# EAGLE design tracking_system (EAGLE 9.4.2)
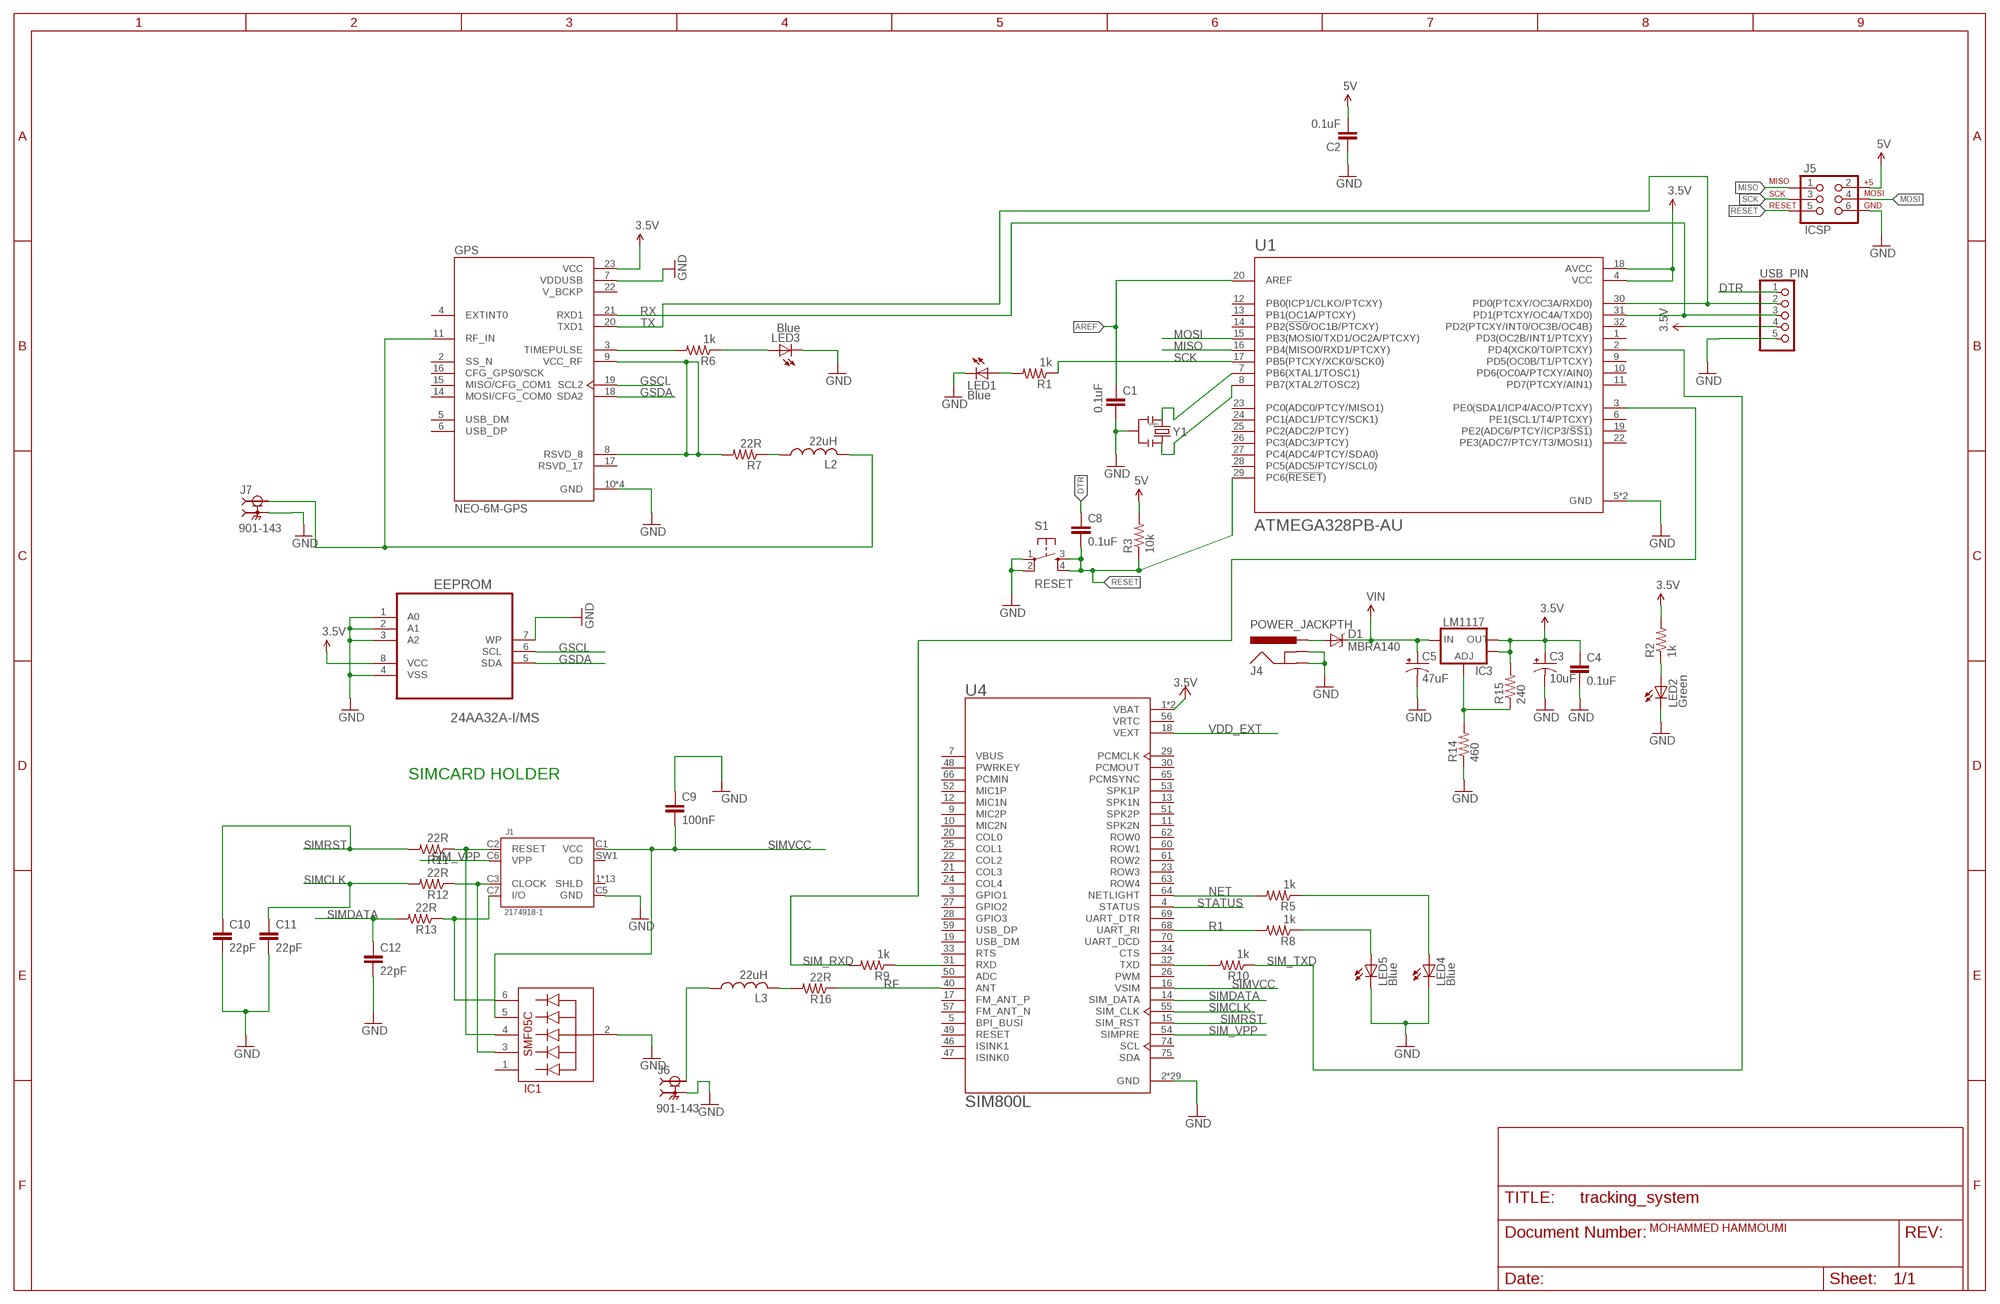
[diagram p0: schematic, sheet 1]

## Parts
C1  0.1uF  CAP0603-CAP  [0603-CAP]
C2  0.1uF  CAP0603-CAP  [0603-CAP]
C3  10uF  CAP_POL1206  [EIA3216]
C4  0.1uF  CAP0603-CAP  [0603-CAP]
C5  47uF  CAP_POLD  [PANASONIC_D]
C8  0.1uF  CAP0603-CAP  [0603-CAP]
C9  100nF  CAP0603-CAP  [0603-CAP]
C10  22pF  CAP0603-CAP  [0603-CAP]
C11  22pF  CAP0603-CAP  [0603-CAP]
C12  22pF  CAP0603-CAP  [0603-CAP]
D1  MBRA140  DIODE-SCHOTTKY_  [SMA-DIODE]
EEPROM  24AA32A-I/MS  [SOP65P490X110-8N]
GPS  NEO-6M-GPS  [XCVR_NEO-6M-GPS]
IC1  SMF05C  [SC-70-6]
IC3  LM1117  V_REG_LM1117ALT1  [SOT223-ALT1]
J1  2174918-1  [TE_2174918-1]
J4  POWER_JACKPTH  [POWER_JACK_PTH]
J5  ICSP  AVR_SPI_PRG_6PTH  [2X3]
J6  901-143  [AMPHENOL_901-143]
J7  901-143  [AMPHENOL_901-143]
L2  22uH  L-USL3225P  [L3225P]
L3  22uH  L-USL3225P  [L3225P]
LED1  Blue  LED1206-NS  [LED-1206-NO_SILK]
LED2  Green  LED1206-NS  [LED-1206-NO_SILK]
LED3  Blue  LED1206-NS  [LED-1206-NO_SILK]
LED4  Blue  LED1206-NS  [LED-1206-NO_SILK]
LED5  Blue  LED1206-NS  [LED-1206-NO_SILK]
R1  1k  RESISTOR0603-RES  [0603-RES]
R2  1k  RESISTOR0603-RES  [0603-RES]
R3  10k  RESISTOR0603-RES  [0603-RES]
R5  1k  RESISTOR0603-RES  [0603-RES]
R6  1k  RESISTOR0603-RES  [0603-RES]
R7  22R  RESISTOR0603-RES  [0603-RES]
R8  1k  RESISTOR0603-RES  [0603-RES]
R9  1k  RESISTOR0603-RES  [0603-RES]
R10  1k  RESISTOR0603-RES  [0603-RES]
R11  22R  RESISTOR0603-RES  [0603-RES]
R12  22R  RESISTOR0603-RES  [0603-RES]
R13  22R  RESISTOR0603-RES  [0603-RES]
R14  460  RESISTOR0603-RES  [0603-RES]
R15  240  RESISTOR0603-RES  [0603-RES]
R16  22R  RESISTOR0603-RES  [0603-RES]
S1  RESET  TAC_SWITCHSMD  [TACTILE_SWITCH_SMD]
U1  ATMEGA328PB-AU  [QFP80P900X900X120-32N]
U4  SIM800L  [MODULE_SIM800L]
USB_PIN  PINHD-1X5  [1X05]
Y1  16MHz  RESONATORSMD  [RESONATOR-SMD]

## Nets
3.3V: EEPROM.8(VCC) GPS.23(VCC) ; supply symbol labelled 3.5V
5V: C2.2 C3.A(+) C4.1 IC3.2(OUT) IC3.4(OUT) J5.2 R2.2 R3.2 R15.2 U1.4(VCC) U1.18(AVCC) USB_PIN.4 ; supply symbol labelled 3.5V
AREF: C1.1 U1.20(AREF)
DTR: C8.1 USB_PIN.1
GND: C1.2 C2.1 C3.C(-) C4.2 C5.- C9.1 C10.2 C11.2 C12.2 EEPROM.1(A0) EEPROM.2(A1) EEPROM.3(A2) EEPROM.4(VSS) EEPROM.7(WP) GPS.7(VDDUSB) GPS.10(GND) GPS.12(GND) GPS.13(GND) GPS.24(GND) IC1.2 J1.C5(GND) J4.GND J4.GNDBREAK J5.6 J6.2 J6.3 J6.4 J6.5 J7.2 J7.3 J7.4 J7.5 LED1.C LED2.C LED3.C LED4.C LED5.C R14.1 S1.1 S1.2 U1.5(GND) U1.21(GND) U4.2(GND) U4.6(GND) U4.8(GND) U4.35(GND) U4.37(GND) U4.38(GND) U4.39(GND) U4.41(GND) U4.43(GND) U4.44(GND) U4.45(GND) U4.58(GND) U4.67(GND) U4.71(GND) U4.72(GND) U4.73(GND) U4.76(GND) U4.77(GND) U4.78(GND) U4.79(GND) U4.80(GND) U4.81(GND) U4.82(GND) U4.83(GND) U4.84(GND) U4.85(GND) U4.86(GND) U4.87(GND) U4.88(GND) USB_PIN.5 Y1.2
GSCL: EEPROM.6(SCL) GPS.19(SCL2)
GSDA: EEPROM.5(SDA) GPS.18(SDA2)
MISO: J5.1 U1.16(PB4(MISO0/RXD1/PTCXY))
MOSI: J5.4 U1.15(PB3(MOSI0/TXD1/OC2A/PTCXY))
N$1: LED2.A R2.1
N$2: LED1.A R1.2
N$3: U1.7(PB6(XTAL1/TOSC1)) Y1.1
N$4: U1.8(PB7(XTAL2/TOSC2)) Y1.3
N$5: D1.A J4.PWR
N$6: GPS.3(TIMEPULSE) R6.2
N$7: LED3.A R6.1
N$8: GPS.8(RSVD_8) GPS.9(VCC_RF) R7.2
N$9: L2.1 R7.1
N$10: GPS.11(RF_IN) J7.1 L2.2
N$11: R9.1 U4.31(RXD)
N$12: R10.2 U4.32(TXD)
N$13: IC1.6 J1.C7(I/O) R13.1
N$14: LED5.A R8.1
N$15: IC3.1(ADJ) R14.2 R15.1
N$16: LED4.A R5.1
N$17: IC1.3 J1.C3(CLOCK) R12.1
N$19: IC1.4 J1.C2(RESET) R11.1
N$20: L3.2 R16.2
N$22: J6.1 L3.1
NET: R5.2 U4.64(NETLIGHT)
R1: R8.2 U4.68(UART_RI)
RESET: C8.2 J5.5 R3.1 S1.3 S1.4 U1.29(PC6(!RESET!))
RF: R16.1 U4.40(ANT)
RX: GPS.21(RXD1) U1.31(PD1(PTCXY/OC4A/TXD0)) USB_PIN.3
SCK: J5.3 R1.1 U1.17(PB5(PTCXY/XCK0/SCK0))
SIM_RXD: R9.2 U1.3(PE0(SDA1/ICP4/ACO/PTCXY))
SIM_TXD: R10.1 U1.2(PD4(XCK0/T0/PTCXY))
SIM_VPP: J1.C6(VPP) U4.54(SIMPRE)
SIMCLK: C11.1 R12.2 U4.55(SIM_CLK)
SIMDATA: C12.1 R13.2 U4.14(SIM_DATA)
SIMRST: C10.1 R11.2 U4.15(SIM_RST)
SIMVCC: C9.2 IC1.5 J1.C1(VCC) U4.16(VSIM)
STATUS: U4.4(STATUS)
TX: GPS.20(TXD1) U1.30(PD0(PTCXY/OC3A/RXD0)) USB_PIN.2
VCC: U4.1(VBAT) U4.42(VBAT) ; supply symbol labelled 3.5V
VDD_EXT: U4.18(VEXT)
VIN: C5.+ D1.C IC3.3(IN)
Unconnected: GPS.2(SS_N) GPS.4(EXTINT0) GPS.5(USB_DM) GPS.6(USB_DP) GPS.14(MOSI/CFG_COM0) GPS.15(MISO/CFG_COM1) GPS.16(CFG_GPS0/SCK) GPS.17(RSVD_17) IC1.1 J1.SW1(CD) U1.1(PD3(OC2B/INT1/PTCXY)) U1.6(PE1(SCL1/T4/PTCXY)) U1.9(PD5(OC0B/T1/PTCXY)) U1.10(PD6(OC0A/PTCXY/AIN0)) U1.11(PD7(PTCXY/AIN1)) U1.12(PB0(ICP1/CLKO/PTCXY)) U1.13(PB1(OC1A/PTCXY)) U1.14(PB2(!SS0!/OC1B/PTCXY)) U1.19(PE2(ADC6/PTCY/ICP3/!SS1!)) U1.22(PE3(ADC7/PTCY/T3/MOSI1)) U1.23(PC0(ADC0/PTCY/MISO1)) U1.24(PC1(ADC1/PTCY/SCK1)) U1.25(PC2(ADC2/PTCY)) U1.26(PC3(ADC3/PTCY)) U1.27(PC4(ADC4/PTCY/SDA0)) U1.28(PC5(ADC5/PTCY/SCL0)) U1.32(PD2(PTCXY/INT0/OC3B/OC4B)) U4.3(GPIO1) U4.5(BPI_BUSI) U4.7(VBUS) U4.9(MIC2P) U4.10(MIC2N) U4.11(SPK2N) U4.12(MIC1N) U4.13(SPK1N) U4.17(FM_ANT_P) U4.19(USB_DM) U4.20(COL0) U4.21(COL3) U4.22(COL2) U4.23(ROW3) U4.24(COL4) U4.25(COL1) U4.26(PWM) U4.27(GPIO2) U4.28(GPIO3) U4.29(PCMCLK) U4.30(PCMOUT) U4.33(RTS) U4.34(CTS) U4.46(ISINK1) U4.47(ISINK0) U4.48(PWRKEY) U4.49(RESET) U4.50(ADC) U4.51(SPK2P) U4.52(MIC1P) U4.53(SPK1P) U4.57(FM_ANT_N) U4.59(USB_DP) U4.60(ROW1) U4.61(ROW2) U4.62(ROW0) U4.63(ROW4) U4.65(PCMSYNC) U4.66(PCMIN) U4.69(UART_DTR) U4.70(UART_DCD) U4.74(SCL) U4.75(SDA)

## Notes on the sheet
- SIMCARD HOLDER
- MOHAMMED HAMMOUMI

## Power pins joined to a net without a drawn wire
SHLD: J1.1(SHLD) J1.2(SHLD) J1.3(SHLD) J1.4(SHLD) J1.5(SHLD) J1.6(SHLD) J1.7(SHLD) J1.8(SHLD) J1.9(SHLD) J1.10(SHLD) J1.11(SHLD) J1.12(SHLD) J1.13(SHLD)
V_BCKP: GPS.22(V_BCKP)
VRTC: U4.56(VRTC)

## Library data of the parts
C1 C2 C4 C8-C12 = SparkFun:CAP: Capacitor Standard 0603 ceramic capacitor, and 0.1" leaded capacitor.; OC_FARNELL: unknown
C3 = SparkFun:CAP_POL: Capacitor Polarized These are standard SMD and PTH capacitors. Normally 10uF, 47uF, and 100uF in electrolytic and tantalum varieties. Always verify the external diameter of the through hole cap, it varies with capacity, voltage, and manufacturer. The EIA devices should be standard.; OC_FARNELL: unknown
C5 = SparkFun:CAP_POL: Capacitor Polarized These are standard SMD and PTH capacitors. Normally 10uF, 47uF, and 100uF in electrolytic and tantalum varieties. Always verify the external diameter of the through hole cap, it varies with capacity, voltage, and manufacturer. The EIA devices should be standard.; MF: PANASONIC ELECTRONIC COMPONENTS; MPN: EEE1CA470SP; OC_FARNELL: 9696946
D1 = SparkFun:DIODE-SCHOTTKY; MF: DIODES INC.; MPN: B140-13-F; OC_FARNELL: 1843670
EEPROM = 24AA32A-I_MS:24AA32A-I/MS: IC EEPROM 32KBIT 400KHZ; AVAILABILITY: Unavailable; DESCRIPTION: 24AA32A Series 32 Kbit _4K X 8_ 5.5 V Surface Mount I2C Serial EEPROM - MSOP-8; MF: Microchip; MP: 24AA32A-I/MS; PACKAGE: MSOP-8 Microchip; PRICE: None
GPS = NEO-6M-GPS:NEO-6M-GPS: SMD GPS Module; AVAILABILITY: Unavailable; DESCRIPTION: SMD GPS Module;; MF: u-blox; MP: NEO-6M-GPS; PACKAGE: None; PRICE: None
IC1 = SMF05C:SMF05C; AVAILABILITY: Unavailable; MF: ON Semiconductor; MP: SMF05C; PACKAGE: SOT-363 ON Semiconductor; PRICE: None
IC3 = Testing:V_REG_LM1117: Voltage Regulator LM1117 Standard adjustable voltage regulator but in SMD form. Spark Fun Electronics SKU : COM-00595; MF: STMICROELECTRONICS; MPN: LD1117S33TR; OC_FARNELL: 1202826
J1 = 2174918-1:2174918-1: PUSH-PUSH SIM CONNECTOR SUPER LO; AVAILABILITY: Unavailable; COMMENT: 2174918-1; DESCRIPTION: Conn SIM Card M 6 POS 2.54mm Solder ST SMD Embossed T/R; EU_ROHS_COMPLIANCE: Compliant; MF: TE Connectivity; MP: 2174918-1; PACKAGE: None; PRICE: None; TE_PURCHASE_URL: https://www.te.com/usa-en/product-2174918-1.html?te_bu=Cor&te_type=disp&te_campaign=seda_glo_cor-seda-global-disp-prtnr-fy19-seda-model-bom-cta_sma-317_1&elqCampaignId=32493
J4 = SparkFun-Connectors:POWER_JACK: Power Jack This is the standard 5.5mm barrel jack for power. The PTH is the most common, proven, reliable, footprint. The Slot footprint only works if the mill layer is transmitted to the PCB fab house so be warned. Mating wall wart : TOL-00298 (and others); OC_FARNELL: unknown; PROD_ID: CONN-08197
J5 = SparkFun-Connectors:AVR_SPI_PRG_6: AVR ISP 6 Pin This is the reduced ISP connector for AVR programming. Common on Arduino. This footprint will take up less PCB space and can be used with a 10-pin to 6-pin adapter such as SKU: BOB-08508 **Special note about "TEST_POINT" package. The stop mask is on the top side, so if you want your programming test points to be on the bottom of your board, make sure to place this package on the bottom side of the board. This also ensure that the orientation to program from the bottom side will be correct.; OC_FARNELL: unknown
J6 = 901-143:901-143: connector, rf coaxial, sma rt angle pcb jack recept, 4 legs, blunt post terminal; AVAILABILITY: Unavailable; DESCRIPTION: connector, rf coaxial, sma rt angle pcb jack recept, 4 legs, blunt post terminal; MF: Amphenol RF; MP: 901-143; PACKAGE: None; PRICE: None
J7 = 901-143:901-143: connector, rf coaxial, sma rt angle pcb jack recept, 4 legs, blunt post terminal; AVAILABILITY: Unavailable; DESCRIPTION: connector, rf coaxial, sma rt angle pcb jack recept, 4 legs, blunt post terminal; MF: Amphenol RF; MP: 901-143; PACKAGE: None; PRICE: None; SPICEPREFIX: B
L2 L3 = rcl:L-US: INDUCTOR, American symbol; SPICEPREFIX: L
LED1-LED5 = SparkFun-LED:LED: LEDs Standard schematic elements and footprints for 5mm, 3mm, 1206, and 0603 sized LEDs. 5mm - Spark Fun Electronics SKU : COM-00529 (and others); OC_FARNELL: unknown
R1-R3 R5-R14 R16 = SparkFun:RESISTOR: Resistor Basic schematic elements and footprints for 0603, 1206, and PTH resistors.; OC_FARNELL: unknown
R15 = SparkFun:RESISTOR: Resistor Basic schematic elements and footprints for 0603, 1206, and PTH resistors.; OC_FARNELL: unknown; SPICEPREFIX: R
S1 = SparkFun:TAC_SWITCH: Momentary Switch Button commonly used for reset or general input. Spark Fun Electronics SKU : COM-00097; OC_FARNELL: unknown
U1 = ATMEGA328PB-AU:ATMEGA328PB-AU: ATmega Series 20 MHz 32 KB Flash 2 KB SRAM 8-Bit Microcontroller - TQFP-32; AVAILABILITY: Unavailable; DESCRIPTION: AVR microcontroller; EEPROM: 1024B; SRAM: 2kB; Flash: 32kB; TQFP32; MF: Microchip; MP: ATMEGA328PB-AU; PACKAGE: TQFP-32 Microchip; PRICE: None
U4 = SIM800L:SIM800L: SIM8000L. Quad-band GSM/GPRS Module; AVAILABILITY: Unavailable; MF: Simcom; MP: SIM800L; PACKAGE: None; PRICE: None
USB_PIN = pinhead:PINHD-1X5: PIN HEADER
Y1 = SparkFun-FreqCtrl:RESONATOR: Resonator Small SMD resonator. This is the itty bitty 10/20MHz resonators with built in caps. CSTCE10M0G55 and CSTCE20M0V53. Footprint has been reviewed closely but hasn't been tested yet.; OC_FARNELL: unknown

## Net classes
0 default: width 0.152 mm, drill 0.305 mm, clearance 0.152 mm

## Board
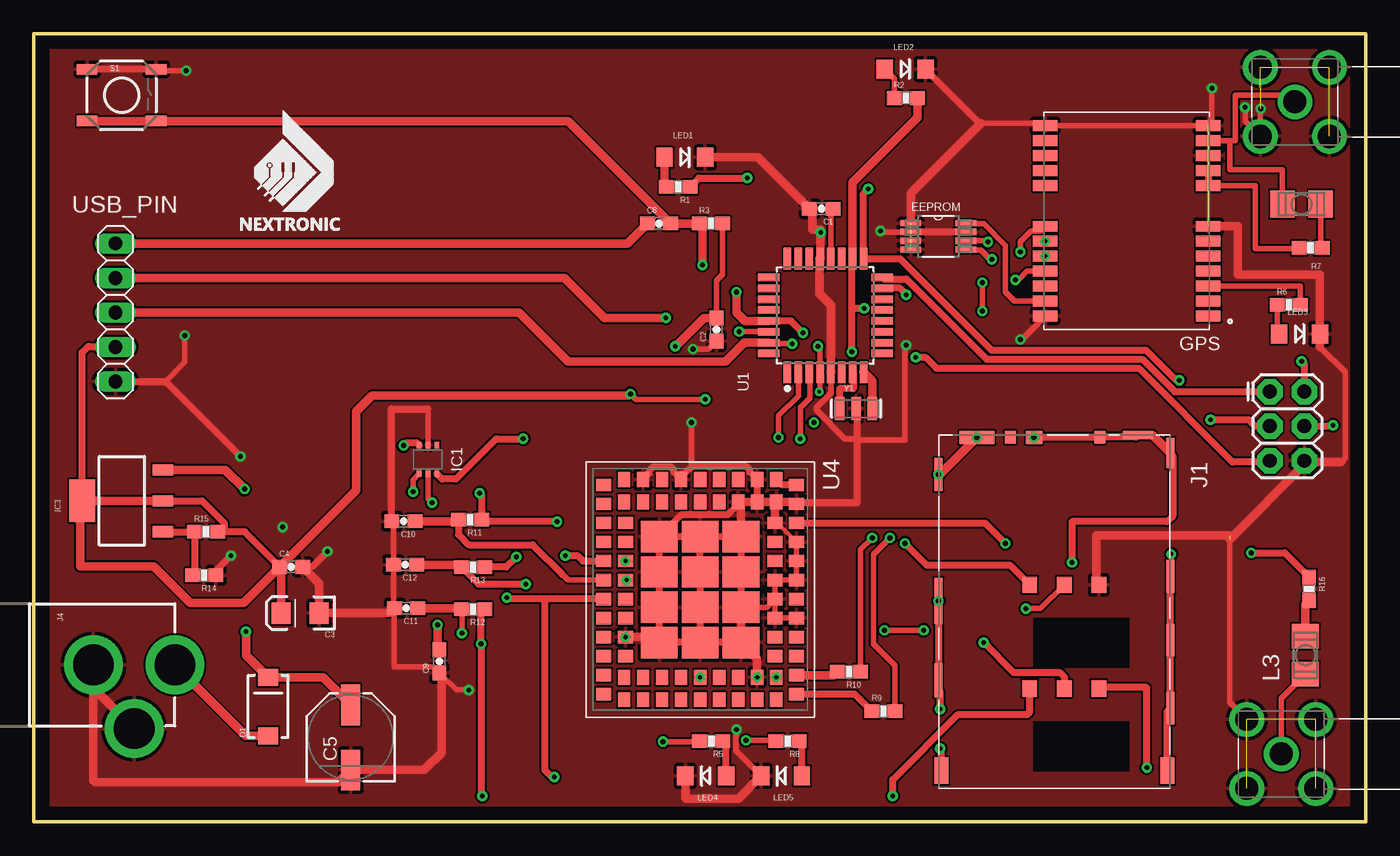
[diagram p1: board, top side]
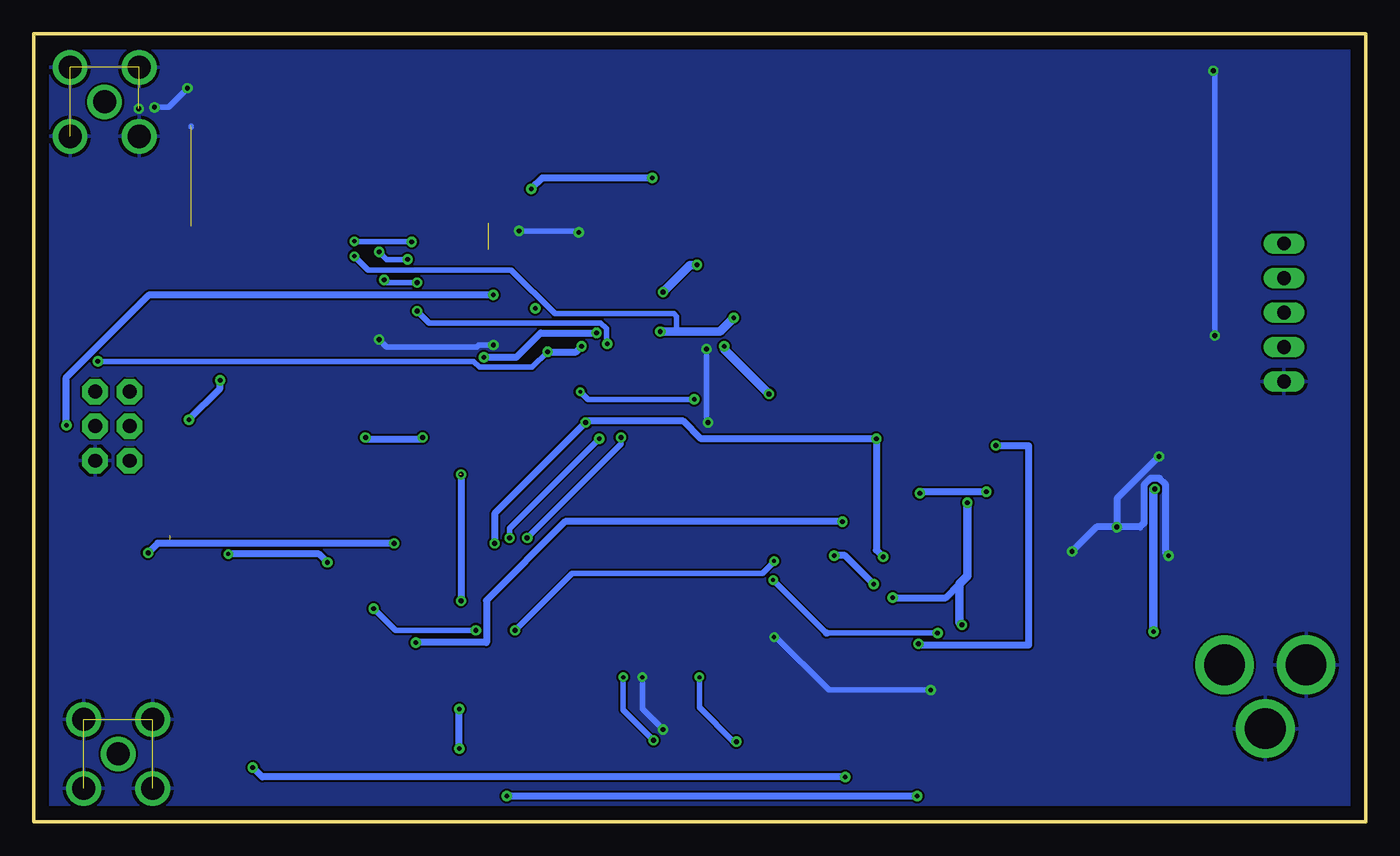
[diagram p2: board, bottom side, seen from below]

Size 98 x 58 mm. Coordinates in mm from the lower left corner, seen from the top.
Outline: 0,0 98,0 98,58 0,58 0,0
Copper layers (1*16): Top 0.035mm / dielectric 1.5mm / Bottom 0.035mm
Design rules "default": minimum track width 6mil, minimum drill 0.35mm, track to track 6mil, track to pad 6mil, pad to pad 6mil, via to via 6mil, smd to smd 6mil, copper to edge 40mil, drill to drill 6mil, minimum pad ring 10mil, minimum via ring 8mil, stop-mask expansion 4mil, vias tented up to drill 0mil, thermal gap 10mil

### Footprints (pad centres in the part's own frame; a part is rotated, then mirrored left to right if it is on the bottom)
0603-CAP = smd 1.1 x 1: 1 -0.85,0; 2 0.85,0
EIA3216 = smd 1.4 x 1.6: A 1.4,0; C -1.4,0
PANASONIC_D = smd 3 x 1.4: + 2.4,0; - -2.4,0
SMA-DIODE = smd 1.27 x 1.47: A -2.15,0; C 2.15,0
SOP65P490X110-8N = smd 1.524 x 0.457: 1 -2.032,0.965; 2 -2.032,0.33; 3 -2.032,-0.33; 4 -2.032,-0.965; 5 2.032,-0.965; 6 2.032,-0.33; 7 2.032,0.33; 8 2.032,0.965
XCVR_NEO-6M-GPS = smd 1.8 x 0.8: 1 -6,7; 2 -6,5.9; 3 -6,4.8; 4 -6,3.7; 5 -6,2.6; 6 -6,1.5; 7 -6,0.4; 8 -6,-2.6; 9 -6,-3.7; 10 -6,-4.8; 11 -6,-5.9; 12 -6,-7; 13 6,-7; 14 6,-5.9; 15 6,-4.8; 16 6,-3.7; 17 6,-2.6; 18 6,0.4; 19 6,1.5; 20 6,2.6; 21 6,3.7; 22 6,4.8; 23 6,5.9; 24 6,7
SC-70-6 = smd 0.35 x 0.5: 1 -0.65,-1.05; 2 0,-1.05; 3 0.65,-1.05; 4 0.65,1.05; 5 0,1.05; 6 -0.65,1.05
SOT223-ALT1 = smd 0.813 x 1.524: 1 -2.271,-3.02; 2 0,-3.02; 3 2.288,-3.02 | smd 3.124 x 1.905: 4 0,2.921
TE_2174918-1 = smd 1.95 x 1.03: 1 11.7,8.315; 13 11.7,-8.315 | smd 2.4 x 0.6: 2 7.1,8.53; 3 2.1,8.53; 4 -2.6,8.53; 10 -10.1,-8.53 | smd 2.23 x 0.6: 5 -11.685,8.53 | smd 0.6 x 2.2: 6 -13,6.15 | smd 0.9 x 0.8: 7 -12.85,3.35; SW1 -12.85,-3.25 | smd 0.95 x 1.2: 8 -12.825,-1.5 | smd 0.95 x 2.6: 9 -12.825,-5.7 | smd 3.4 x 0.6: 11 -0.8,-8.53 | smd 2.5 x 0.6: 12 5.05,-8.53 | smd 1.2 x 1.1: C1 5.65,3.26; C2 5.65,0.72; C3 5.65,-1.82; C5 -1.97,3.26; C6 -1.97,0.72; C7 -1.97,-1.82
POWER_JACK_PTH = drill 2.997 pad 4.318: GND 0,7.7; GNDBREAK 4.7,10.7; PWR 0,13.7
2X3 = drill 1.016 pad 1.88 octagon: 1 0,0; 2 0,2.54; 3 2.54,0; 4 2.54,2.54; 5 5.08,0; 6 5.08,2.54
AMPHENOL_901-143 = drill 1.7: 1 0,0; 2 -2.54,2.54; 3 -2.54,-2.54; 4 2.54,-2.54; 5 2.54,2.54
L3225P = smd 1.8 x 2: 1 -1.4,0; 2 1.4,0
LED-1206-NO_SILK = smd 1.2 x 1.4: A -1.5,0; C 1.5,0
0603-RES = smd 1.1 x 1: 1 -0.85,0; 2 0.85,0
TACTILE_SWITCH_SMD = smd 1.524 x 0.762: 1 -2.54,1.905; 2 2.54,1.905; 3 -2.54,-1.905; 4 2.54,-1.905
QFP80P900X900X120-32N = smd 1.6 x 0.55: 1 -4.18,2.8; 2 -4.18,2; 3 -4.18,1.2; 4 -4.18,0.4; 5 -4.18,-0.4; 6 -4.18,-1.2; 7 -4.18,-2; 8 -4.18,-2.8; 17 4.18,-2.8; 18 4.18,-2; 19 4.18,-1.2; 20 4.18,-0.4; 21 4.18,0.4; 22 4.18,1.2; 23 4.18,2; 24 4.18,2.8 | smd 0.55 x 1.6: 9 -2.8,-4.18; 10 -2,-4.18; 11 -1.2,-4.18; 12 -0.4,-4.18; 13 0.4,-4.18; 14 1.2,-4.18; 15 2,-4.18; 16 2.8,-4.18; 25 2.8,4.18; 26 2,4.18; 27 1.2,4.18; 28 0.4,4.18; 29 -0.4,4.18; 30 -1.2,4.18; 31 -2,4.18; 32 -2.8,4.18
MODULE_SIM800L = smd 1.1 x 0.9: 1 -8.1,5.6; 2 -8.1,4.2; 3 -8.1,2.8; 4 -8.1,1.4; 5 -8.1,0; 6 -8.1,-1.4; 7 -8.1,-2.8; 8 -8.1,-4.2; 9 -8.1,-5.6; 22 8.1,-5.6; 23 8.1,-4.2; 24 8.1,-2.8; 25 8.1,-1.4; 26 8.1,0; 27 8.1,1.4; 28 8.1,2.8; 29 8.1,4.2; 30 8.1,5.6; 43 -6.45,5.6; 44 -6.45,4.2; 45 -6.45,2.8; 46 -6.45,1.4; 47 -6.45,0; 48 -6.45,-1.4; 49 -6.45,-2.8; 50 -6.45,-4.2; 51 -6.45,-5.6; 60 6.45,-5.6; 61 6.45,-4.2; 62 6.45,-2.8; 63 6.45,-1.4; 64 6.45,0; 65 6.45,1.4; 66 6.45,2.8; 67 6.45,4.2; 68 6.45,5.6 | smd 0.9 x 1.1: 10 -7.7,-7.1; 11 -6.3,-7.1; 12 -4.9,-7.1; 13 -3.5,-7.1; 14 -2.1,-7.1; 15 -0.7,-7.1; 16 0.7,-7.1; 17 2.1,-7.1; 18 3.5,-7.1; 19 4.9,-7.1; 20 6.3,-7.1; 21 7.7,-7.1; 31 7.7,7.1; 32 6.3,7.1; 33 4.9,7.1; 34 3.5,7.1; 35 2.1,7.1; 36 0.7,7.1; 37 -0.7,7.1; 38 -2.1,7.1; 39 -3.5,7.1; 40 -4.9,7.1; 41 -6.3,7.1; 42 -7.7,7.1; 52 -4.9,-5.5; 53 -3.5,-5.5; 54 -2.1,-5.5; 55 -0.7,-5.5; 56 0.7,-5.5; 57 2.1,-5.5; 58 3.5,-5.5; 59 4.9,-5.5; 69 4.9,5.5; 70 3.5,5.5; 71 2.1,5.5; 72 0.7,5.5; 73 -0.7,5.5; 74 -2.1,5.5; 75 -3.5,5.5; 76 -4.9,5.5 | smd 2.3 x 2.7: 77 -3.9,3; 78 -3.9,0; 79 -3.9,-3; 80 -1.3,-3; 81 1.3,-3; 82 3.9,-3; 83 3.9,0; 84 3.9,3; 85 1.3,3; 86 -1.3,3; 87 -1.3,0; 88 1.3,0
1X05 = drill 1.016 long: 1 -5.08,0; 2 -2.54,0; 3 0,0; 4 2.54,0; 5 5.08,0
RESONATOR-SMD = smd 0.7 x 1.7: 1 -1.2,0; 2 0,0; 3 1.2,0

### Placement (x,y rotation side)
C1  57.94,45.13 180 top
C2  50.23,36.25 90 top
C3  19.61,15.37 180 top
C4  18.94,18.77 0 top
C5  23.31,6.22 90 top
C8  46.01,44.05 0 top
C9  29.83,11.82 90 top
C10  27.19,22.13 180 top
C11  27.4,15.73 180 top
C12  27.31,18.93 180 top
D1  17.23,8.49 90 top
EEPROM  66.56,43.1 0 top
GPS  80.42,44.24 180 top
IC1  29,26.68 180 top
IC3  6.47,23.63 90 top
J1  75.1,15.47 270 top
J4  -3.33,11.56 270 top
J5  90.96,31.67 270 top
J6  91.8,5 270 top
J7  92.8,53 270 top
L2  93.29,45.47 180 top
L3  93.57,12.26 90 top
LED1  47.9,48.92 0 top
LED2  64.12,55.42 0 top
LED3  93.14,35.92 0 top
LED4  49.44,3.38 180 top
LED5  55.02,3.38 180 top
R1  47.42,46.73 180 top
R2  64.17,53.27 0 top
R3  49.84,44.05 0 top
R5  49.84,5.95 180 top
R6  92.35,38.05 0 top
R7  93.96,42.25 180 top
R8  55.47,5.95 180 top
R9  62.52,8.15 0 top
R10  59.99,11.05 180 top
R11  32.1,22.25 180 top
R12  32.31,15.65 180 top
R13  32.32,18.75 180 top
R14  12.53,18.15 180 top
R15  12.66,21.35 0 top
R16  93.85,17.15 270 top
S1  6.45,53.49 0 top
U1  58.25,37.28 90 top
U4  49.03,17.1 270 top
USB_PIN  6,37.5 270 top
Y1  60.5,30.42 0 top

### Tracks (layer width: path | path; a pad name or v marks a point on that pad's centre or on a via)
3.3V
  Top 0.406: EEPROM.8 68.62,44.04 69.9,44.04 71.5,42.44 71.5,39 72.16,38.34 GPS.23
5V  (via drill 0.25, 0.35)
  Top 0.406: C2.2 50.23,39.83 50.69,40.28 R3.2 | v57.79,31.66 57.85,31.72 U1.4 57.85,34.85 v57.7,35 | v49.4,31.1 44.3,31.1 v43.9,31.5
  Top 0.508: C4.1 15.51,21.35 14,21.35 | 14,21.35 R15.2 | IC3.2 12.37,23.63 14,22 14,21.35 | USB_PIN.4 5.96,35 4,35 3.55,34.55 IC3.4 3.4,23.48 | v60.2,34.6 60.2,37.8 | 60.2,37.8 60.2,41.41 U1.18 | v61.1,37.8 60.2,37.8 | v93.3,33.9 93.5,33.7 J5.2
  Top 0.61: R2.2 65.02,51.82 60.25,47.05 U1.18 | C4.1 18.2,18.66 C3.A | C4.1 15.42,16.1 11.5,16.1 8.8,18.8 3.4,18.8 3.4,23.48 | C4.1 23.7,24.38 23.7,30.2 24.9,31.4 43.8,31.4 v43.9,31.5 | v47.2,35 49.3,37.1 C2.2 | IC3.2 IC3.4
  Bottom 0.406: v93.3,33.9 65.64,33.9 65.2,33.47 61.33,33.47 v60.2,34.6 | v57.79,31.66 57.23,31.1 v49.4,31.1
  Bottom 0.508: v60.2,34.6 58.1,34.6 v57.7,35
  Bottom 0.61: v43.9,31.5 47.2,34.8 v47.2,35
AREF
  Top 0.406: U1.20 58.65,44.99 C1.1
DTR
  Top 0.61: C8.1 43.69,42.58 USB_PIN.1
GND  (via drill 0.3, 0.35)  (13 unrouted)
  Top 0.305: U4.76 54.73,22 55.27,21.45 55.27,21.42 55.45,21.25 55.48,21.25 U4.39
  Top 0.406: U4.39 U4.38 U4.37 U4.73 U4.72 | U4.72 U4.71 U4.35 | U4.85 53.93,15.8 U4.72 | C10.2 26.46,22.01 C12.2 26.46,15.82 C11.2 26.5,15.68 26.5,11.4 29.4,11.4 C9.1 | 69.7,51.44 74.42,51.44 GPS.13 GPS.12 86.7,51.52 v86.7,54 | J6.3 88.01,8.79 88.01,21.1 | v90.3,52.5 90.26,52.46 J7.4 89.13,51.59 v89.13,52.6 | 30,10.8 31.1,9.7 v32,9.7 | v51.7,6.8 51.7,6.34 51.67,6.3 51.67,5.23 LED5.C | 29,30.4 IC1.2 | 9.68,32.42 11.1,33.84 v11.1,35.8 | v11.2,55.3 9.09,55.3 S1.2 | U1.5 58.65,31.55 57.6,30.5 57.6,30.3 59.7,28.2 60.6,28.2 60.7,28.1 64.1,28.1 64.1,35 v64.2,35.1 | EEPROM.2 62.37,43.43 v62.3,43.5 | GPS.24 72.7,35.52 72.7,35.5 v72.61,35.5 v72.6,35.51 | C2.1 49.63,34.8 v48.5,34.8 | v48.4,29.4 48.4,26.17 48.41,26.16 | 96.2,26.5 96.5,26.8 96.5,33.1 94.64,34.96
  Top 0.508: 29,30.4 26.3,30.4 26.3,22.17 C10.2 | EEPROM.7 EEPROM.2 | GPS.13 74.52,51.14 | R14.1 13.38,18.48 v14.5,19.6 | v21.6,19.9 20.47,18.77 C4.2 | U4.78 U4.87 U4.88 49.03,13.83 49,13.8 49,13.23 U4.83 | U4.83 U4.82 U4.81 U4.80 U4.79 | U4.79 U4.78 | U4.78 U4.77 U4.86 52.03,15.5 | U4.84 U4.83 | U4.8 45.27,25.64 45.27,25.82 45.61,26.16 46.85,26.16 47.09,25.92 47.09,25.74 47.27,25.57 | 47.27,25.57 U4.6 | U4.44 U4.2 52.69,25.74 52.69,25.92 52.45,26.16 48.41,26.16 47.82,25.57 47.27,25.57 | U4.41 56.23,23.5 60.6,23.5 60.6,28.2 60.6,30.32 Y1.2 | U4.79 47.62,22.59 51.05,22.59 51.8,23.35 52.03,23.35 | S1.2 S1.1 | USB_PIN.5 9.68,32.42 v15.2,26.9 | LED2.C 69.6,51.44 69.7,51.44
  Top 0.61: U4.58 45.63,13.6 U4.82 | LED5.C 51.84,1.7 48,1.7 47.94,1.76 LED4.C | U1.5 58.65,38.05 57.8,38.9 57.8,41.41 U1.21 57.9,41.51 v57.9,43.4 57.9,43.6 57.3,43.6 57.3,44.92 C1.2 53.3,48.92 LED1.C | EEPROM.1 64.53,46.27 69.7,51.44 | GPS.7 88.6,43.84 88.6,40.3 94.64,40.3 LED3.C 94.64,34.96 | 96.2,26.5 93.59,26.5 J5.6 93.5,26.29 88.01,20.8 | 88.01,21.1 78.2,21.1 78.2,17.6 J1.C5 | U4.67 53.23,12 U4.84 52.03,15.5 U4.85 | U4.77 52.03,23.35 U4.45 U4.44 U4.43 | U4.43 54.53,23.45 U4.76 | U4.43 55.98,23.55 U4.41 | C9.1 30,10.8 30,5.1 28.72,3.82 C5.- 22.39,2.9 4.5,2.9 4.37,3.03 J4.GND 4.37,9.86 J4.GNDBREAK | C4.2 21,17.55 C3.C 26.19,15.37 26.5,15.68
  Bottom 0.406: 86.42,51.22 86.42,51.14 | v32,9.7 39.5,9.7 43.5,13.7 43.53,13.67 U4.58 | U4.67 53.23,8.33 v51.7,6.8 | v11.1,35.8 11.1,55.2 v11.2,55.3 | v62.3,43.5 58,43.5 v57.9,43.4 | v64.2,35.1 65.26,35.1 65.4,34.97 72.06,34.97 v72.6,35.51 | v48.5,34.8 48.5,29.5 v48.4,29.4 | v89.13,52.6 88.1,52.6 v86.7,54
  Bottom 0.508: v18.3,21.7 16.6,21.7 16.31,21.99 16.31,24.8 15.82,25.29 15.18,25.29 14.71,24.82 14.71,19.82 v14.5,19.6 | v18.3,21.7 19.8,21.7 v21.6,19.9 | v15.2,26.9 18.3,23.8 v18.3,21.7
  other vias: 43.53,13.6 53.23,10.65
  pour Top: -1,59 -1,-1 99,-1 99,59
  pour Bottom: -1,58 -1,-1 99,-1 99,59 -1,59
GSCL  (via drill 0.3, 0.35)
  Top 0.406: EEPROM.6 70.13,42.77 v70.2,42.7
  Bottom 0.406: GPS.19 74.38,42.7 v70.2,42.7
  other vias: 74.42,42.74
GSDA  (via drill 0.35)
  Top 0.406: EEPROM.5 68.63,42.1 69.7,42.1 70.4,41.4 v70.5,41.4 | GPS.18 74.08,43.5 73.37,43.5 72.6,42.72 v72.6,41.97
  Bottom 0.406: v70.5,41.4 72.03,41.4 v72.6,41.97
MISO
  Top 0.508: U1.16 62.55,39.96 64.2,39.96 70.1,34.06 81.57,34.06 83.96,31.67 J5.1
MOSI  (via drill 0.35)
  Top 0.508: J5.4 95.53,29.13 v95.6,29.2 | v64.2,38.8 63.72,39.28 U1.15
  Bottom 0.508: v95.6,29.2 95.65,29.25 95.65,32.66 89.51,38.8 v64.2,38.8
N$1
  Top 0.406: LED2.A 63.32,54.72 R2.1
N$2
  Top 0.61: LED1.A 46.4,46.9 R1.2
N$3
  Top 0.508: U1.7 60.3,33.1 60.3,31.89 59.3,31.89 Y1.1
N$4
  Top 0.61: U1.8 61.7,32.45 Y1.3
N$5
  Top 0.61: J4.PWR 15.59,6.34 D1.A
N$6
  Top 0.406: R6.2 93.2,39.44 GPS.3
N$7
  Top 0.406: LED3.A 91.5,35.92 R6.1
N$8
  Top 0.406: GPS.8 89.9,46.84 89.9,42.2 93.06,42.2 R7.2
  Top 0.508: GPS.9 GPS.8
N$9
  Top 0.406: R7.1 94.67,42.25 94.69,42.45 L2.1
N$10
  Top 0.406: GPS.11 88,50.14 | J7.1 92.8,53.5 88.4,53.5 88.4,50.14 88,50.14 | L2.2 91.89,48 88,48 88,50.14
N$11
  Top 0.508: R9.1 60.42,9.4 U4.31
N$12
  Top 0.61: R10.2 58.89,10.8 U4.32
N$13  (via drill 0.35)
  Top 0.508: IC1.6 30.05,25.23 31.05,25.23 34.02,28.2 v36,28.2 | v35.5,19.5 34.75,18.75 R13.1 | v64.1,20.5 65.7,18.9 71.82,18.9 J1.C7
  Bottom 0.508: v35.5,19.5 36,20 v36,28.2 48.9,28.2 50.2,29.5 57.3,29.5 v57.4,29.4 64.1,22.7 v64.1,20.5
N$14
  Top 0.508: LED5.A 56.52,5.75 R8.1
N$15
  Top 0.508: 12,18.47 R14.2 11.81,18.28 R15.1 IC3.1
N$16
  Top 0.508: LED4.A 50.94,5.7 R5.1
N$17  (via drill 0.35)
  Top 0.508: IC1.3 28.18,27.9 27.4,27.9 v27.2,27.7 | R12.1 32.9,15.65 v32.9,13.1 32.9,2 v33,1.9 | v63.2,1.9 63.2,3.1 68,7.9 73.1,7.9 73.28,8.08 J1.C3
  Bottom 0.508: v27.2,27.7 24.8,27.7 24.8,13 32.9,13 v32.9,13.1 | v33,1.9 v63.2,1.9
N$19  (via drill 0.35)
  Top 0.406: v27.9,24.3 27.9,25.18 IC1.4
  Top 0.508: v32.8,24.2 32.95,24.05 R11.1 33.1,22.1 v38.5,22.1 | v69.9,13.2 72.1,11 75.5,11 75.82,10.68 J1.C2
  Bottom 0.508: v27.9,24.3 32.7,24.3 v32.8,24.2 | v38.5,22.1 58.9,22.1 64.7,16.3 64.7,13.2 v69.9,13.2
N$20
  Top 0.61: L3.2 93.57,16.02 R16.2
N$22
  Top 0.406: L3.1 91.8,9.09 J6.1
NET  (via drill 0.3, 0.35)
  Top 0.406: v46.3,5.9 48.94,5.9 R5.2
  Bottom 0.406: v46.3,5.9 46.5,5.9 49.03,8.43 U4.64
  other vias: 49.03,10.65
R1  (via drill 0.3, 0.35)
  Top 0.406: v52.4,6 54.57,6 R8.2
  Bottom 0.406: v52.4,6 54.63,8.23 54.63,10.57 54.6,10.6 54.6,10.62 U4.68
  other vias: 54.63,10.65
RESET  (via drill 0.35)
  Top 0.508: J5.5 90.86,26.49 88.21,26.49 81.3,33.4 66.4,33.4 65.6,34.2 v64.9,34.2 | v56.6,36 55.72,36.88 U1.29
  Top 0.61: v49.2,41 49.2,43.84 R3.1 C8.2 39.32,51.59 S1.4 S1.3 | v51.7,39 51.7,37.5 52.32,36.88 U1.29
  Bottom 0.508: v64.9,34.2 62.5,34.2 60.7,36 v56.6,36
  Bottom 0.61: v49.2,41 49.7,41 v51.7,39
RF  (via drill 0.35)
  Top 0.508: U4.40 70,22 v71.5,20.5 | v89.6,19.8 92.05,19.8 R16.1
  Bottom 0.508: v71.5,20.5 88.9,20.5 v89.6,19.8
RX  (via drill 0.35)
  Top 0.406: GPS.21 73.07,40.54 72.43,39.9 v72.23,39.9 | v69.8,39.7 v69.8,37.6 | v55.8,35.2 54.15,35.2 U1.31
  Top 0.61: U1.31 52.28,35.28 50.9,33.9 39.3,33.9 35.7,37.5 USB_PIN.3
  Bottom 0.406: v72.23,39.9 72.03,39.7 v69.8,39.7 | v69.8,37.6 68.93,36.73 56.3,36.73 55.87,36.3 55.87,35.27 v55.8,35.2
SCK  (via drill 0.35)
  Top 0.508: R1.1 48.94,47.4 v52.5,47.4 | v61.4,46.6 61.05,46.25 U1.17 63.73,41.46 70.47,34.72 81.85,34.72 84.07,32.5 v84.3,32.5 | v86.6,29.6 89.39,29.6 89.86,29.13 J5.3
  Bottom 0.508: v52.5,47.4 60.6,47.4 v61.4,46.6 | v86.6,29.6 84.3,31.9 v84.3,32.5
SHLD  (via drill 0.3, 0.35)  (1 unrouted)
  Top 0.406: J1.4 83.7,18.14 v83.7,19.71
  Top 0.508: J1.1 83.42,8.15 J1.2 J1.3 J1.4 | J1.6 81.1,28.32 J1.7 73.62,28.32 J1.8 | 83.63,19.64 v83.7,19.71 | J1.5 83.8,26.98 83.8,22.5 83.4,22.1 76.4,22.1 v76.4,19.1 | J1.11 J1.12 66.57,9.73 66.7,9.6 v66.7,8.3 | J1.13 66.78,5.32 v66.7,5.4
  Top 0.61: J1.9 66.67,25.57 | J1.6 82.31,28.47 J1.5
  Bottom 0.508: J1.8 73.6,28.2 69.5,28.2 J1.9 | v76.4,19.1 77.02,19.71 v83.7,19.71 | J1.10 66.57,16.33 66.63,16.27 J1.11 | v66.7,5.4 v66.7,8.3
  other vias: 73.6,28.3 69.4,28.3 66.57,25.57 66.57,16.27
SIM_RXD  (via drill 0.35)
  Top 0.406: R9.2 63.37,11.53 61.8,13.1 61.8,19.7 v63,20.9 | v56.4,28.2 56.4,30.5 57.1,31.2 57.1,33.05 U1.3
  Bottom 0.406: v63,20.9 63,21.6 v56.4,28.2
SIM_TXD  (via drill 0.35)
  Top 0.406: R10.1 60.84,20.04 v61.7,20.9 | v54.8,28.3 54.8,29.9 56.25,31.35 U1.2
  Bottom 0.406: v61.7,20.9 54.8,27.8 v54.8,28.3
SIM_VPP  (via drill 0.3, 0.35)
  Top 0.406: v62.6,14.1 v65.48,14.1 | v73,15.7 74.08,15.7 J1.C6
  Bottom 0.406: v62.6,14.1 58.4,18.3 44.37,18.3 43.5,19.17 | v65.48,14.1 71.4,14.1 v73,15.7
  Bottom 0.508: 43.5,19.17 U4.54
  other vias: 43.53,19.2
SIMCLK  (via drill 0.3, 0.35)
  Top 0.406: v31.5,13.9 31.5,15.61 R12.2 | v43.6,17.8 U4.55
  Top 0.61: C11.1 31.38,15.73 R12.2
  Bottom 0.406: v31.5,13.9 39.63,13.9 | 39.7,13.9 v43.6,17.8
  Bottom 0.508: 39.63,13.9 39.7,13.9 | 43.6,17.79 v43.6,17.8
SIMDATA  (via drill 0.35)
  Top 0.508: R13.2 32.72,17.5 v36.2,17.5 | v39.1,19.6 40,19.6 40.4,19.2 U4.14
  Top 0.61: C12.1 31.29,18.93 R13.2
  Bottom 0.508: v36.2,17.5 38.3,19.6 v39.1,19.6
SIMRST
  Top 0.406: 38.9,18.2 39.3,17.8 U4.15
  Top 0.508: R11.2 31.25,21.15 32,20.4 36.7,20.4 38.9,18.2
  Top 0.61: C10.1 31.13,22.13 R11.2
SIMVCC  (via drill 0.35)
  Top 0.406: v29.3,23.5 29,23.8 IC1.5
  Top 0.508: U4.16 37.6,16.4 | 37.6,16.4 34.9,16.4 v34.8,16.5 | 37.6,16.4 37.6,3.8 38.1,3.3 v38.3,3.3 | v81.9,4 81.9,9.9 78.44,9.9 J1.C1
  Top 0.61: C9.2 29.7,12.8 v29.7,14.5
  Bottom 0.508: v34.8,16.5 30.9,16.5 29.9,17.5 | v38.3,3.3 81.2,3.3 v81.9,4
  Bottom 0.61: v29.3,23.5 29.3,18.1 29.9,17.5 29.9,14.7 v29.7,14.5
TX  (via drill 0.25, 0.3, 0.35)
  Top 0.406: v51.9,36.1 54.05,36.1 U1.30 | GPS.20 74.42,41.62
  Top 0.61: v46.5,37.1 42,37.1 39.06,40.04 USB_PIN.2
  Bottom 0.406: GPS.20 73.41,40.63 62.9,40.63 59.66,37.4 50.9,37.4 50.7,37.2 50.7,36.1
  Bottom 0.61: v51.9,36.1 50.7,36.1 47.5,36.1 v46.5,37.1
  other vias: 74.42,41.64 74.42,41.64
VCC
  Top 0.508: U4.42 55.03,24.8 U4.1
VIN  (via drill 0.35)
  Top 0.61: C5.+ 21.29,10.64 D1.C 15.6,12.27 v15.6,14 | v15.5,24.5 14.08,25.92 IC3.3
  Bottom 0.61: v15.6,14 15.6,24.5 v15.5,24.5